# Altium project MLX90640_PCB_Project.PrjPCB
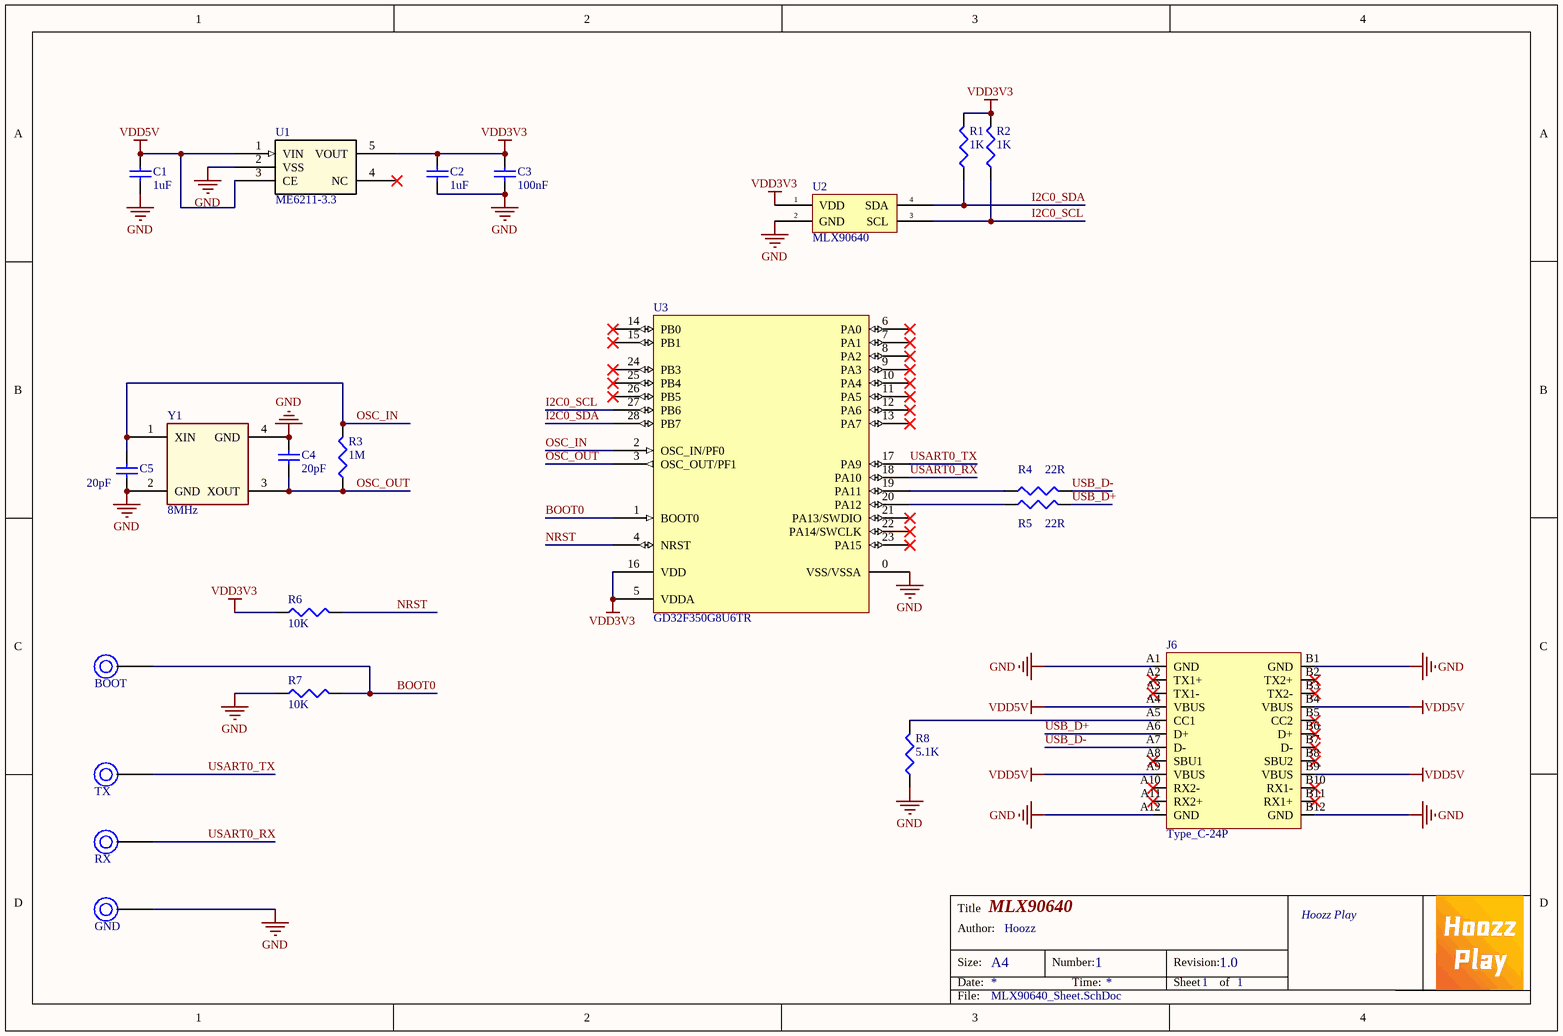
[diagram p0: MLX90640_Sheet.SchDoc]
1 sheet, 22 parts. Net scope: global (net labels, ports and power ports of the same name join across sheets).
Board file: MLX90640_PCB.PcbDoc

## Sheet MLX90640_Sheet.SchDoc: MLX90640
size A4; Author: Hoozz; DrawnBy: Hoozz; Organization: Hoozz Play; DocumentNumber: 1; Revision: 1.0; SheetNumber: 1; SheetTotal: 1

### Parts
BOOT  TEST-PORT  [TEST-PORT]  (value not drawn)
C1  value 1uF  [0603]  (hidden comment: Cap)
C2  value 1uF  [0603]  (hidden comment: Cap)
C3  value 100nF  [0603]  (hidden comment: Cap)
C4  value 20pF  [0603]  (hidden comment: Cap)
C5  value 20pF  [0603]  (hidden comment: Cap)
GND  TEST-PORT  [TEST-PORT]  (value not drawn)
J6  Type_C-24P  [Type_C-24P-A]
R1  value 1K  [0603]  (hidden comment: Res)
R2  value 1K  [0603]  (hidden comment: Res)
R3  value 1M  [0603]  (hidden comment: Res)
R4  value 22R  [0603]  (hidden comment: Res)
R5  value 22R  [0603]  (hidden comment: Res)
R6  value 10K  [0603]  (hidden comment: Res)
R7  value 10K  [0603]  (hidden comment: Res)
R8  value 5.1K  [0603]  (hidden comment: Res)
RX  TEST-PORT  [TEST-PORT]  (value not drawn)
TX  TEST-PORT  [TEST-PORT]  (value not drawn)
U1  ME6211-3.3  [SOT-23-5]
U2  MLX90640  [MLX90640]
U3  GD32F350G8U6TR  [QFN28_4X4X0.8]
Y1  8MHz  [3225]

### Nets
GND: C1.1 C2.1 C3.1 C4.2 C5.1 GND.T J6.A1(GND) J6.A12(GND) J6.B1(GND) J6.B12(GND) R7.1 R8.1 U1.2(VSS) U2.2(GND) U3.0(VSS/VSSA) Y1.2(GND) Y1.4(GND)
VDD3V3: C2.2 C3.2 R1.2 R2.2 R6.1 U1.5(VOUT) U2.1(VDD) U3.5(VDDA) U3.16(VDD)
VDD5V: C1.2 J6.A4(VBUS) J6.A9(VBUS) J6.B4(VBUS) J6.B9(VBUS) U1.1(VIN) U1.3(CE)
BOOT0: BOOT.T R7.2 U3.1(BOOT0)
I2C0_SCL: R2.1 U2.3(SCL) U3.27(PB6)
I2C0_SDA: R1.1 U2.4(SDA) U3.28(PB7)
NRST: R6.2 U3.4(NRST)
OSC_IN: C5.2 R3.2 U3.2(OSC_IN/PF0) Y1.1(XIN)
OSC_OUT: C4.1 R3.1 U3.3(OSC_OUT/PF1) Y1.3(XOUT)
USART0_RX: RX.T U3.18(PA10)
USART0_TX: TX.T U3.17(PA9)
USB_D+: J6.A6(D+) R5.2
USB_D-: J6.A7(D-) R4.2
NetJ6_A5: J6.A5(CC1) R8.2
NetR4_1: R4.1 U3.19(PA11)
NetR5_1: R5.1 U3.20(PA12)

Not connected (* = marked no-connect by the designer): J6 A2(TX1+)* A3(TX1-)* A8(SBU1)* A10(RX2-)* A11(RX2+)* B2(TX2+)* B3(TX2-)* B5(CC2)* B6(D+)* B7(D-)* B8(SBU2)* B10(RX1-)* B11(RX1+)*; U1 4(NC)*; U3 6(PA0)* 7(PA1)* 8(PA2)* 9(PA3)* 10(PA4)* 11(PA5)* 12(PA6)* 13(PA7)* 14(PB0)* 15(PB1)* 21(PA13/SWDIO)* 22(PA14/SWCLK)* 23(PA15)* 24(PB3)* 25(PB4)* 26(PB5)*

### Notes on the sheet
- Title
- Size:
- Date:
- Author:
- A4
- Number:
- Time:
- Revision:
- Sheet
- of
- File:

### Library data of the parts
C1-C5 = Cap: Capacitor; Published: 8-Jun-2000; LatestRevisionDate: 17-Jul-2002; LatestRevisionNote: Re-released for DXP Platform.; PackageReference: RAD-0.3; Publisher: Altium Limited; PackageDescription: Radial Cap, Thru-Hole; 2 Leads; 0.3 in Pin Spacing
J6 = Type_C-24P: USB Type C
R1-R8 = Res: Resistor; Published: 8-Jun-2000; LatestRevisionDate: 29-May-2009; LatestRevisionNote: IPC-7351 Footprint Added.; PackageReference: J1-0603; Publisher: Altium Limited; PackageDescription: Chip Resistor
U1 = ME6211-3.3: No Description Available; Manufacturer: Texas Instruments; Manufacturer_Part_Number: REG102NA-2.5/250; Built_By: EMA_UL_Team; SourceLibrary: TI_2016-07-06; Vendor: Texas Instruments; Copyright: Copyright (C) 2018 Accelerated Designs. All rights reserved; RefDes: RefDes; Type: DEV
U3 = GD32F350GxUx
Y1 = XTAL2